# EAGLE design crz7shld (EAGLE 9.6.2)
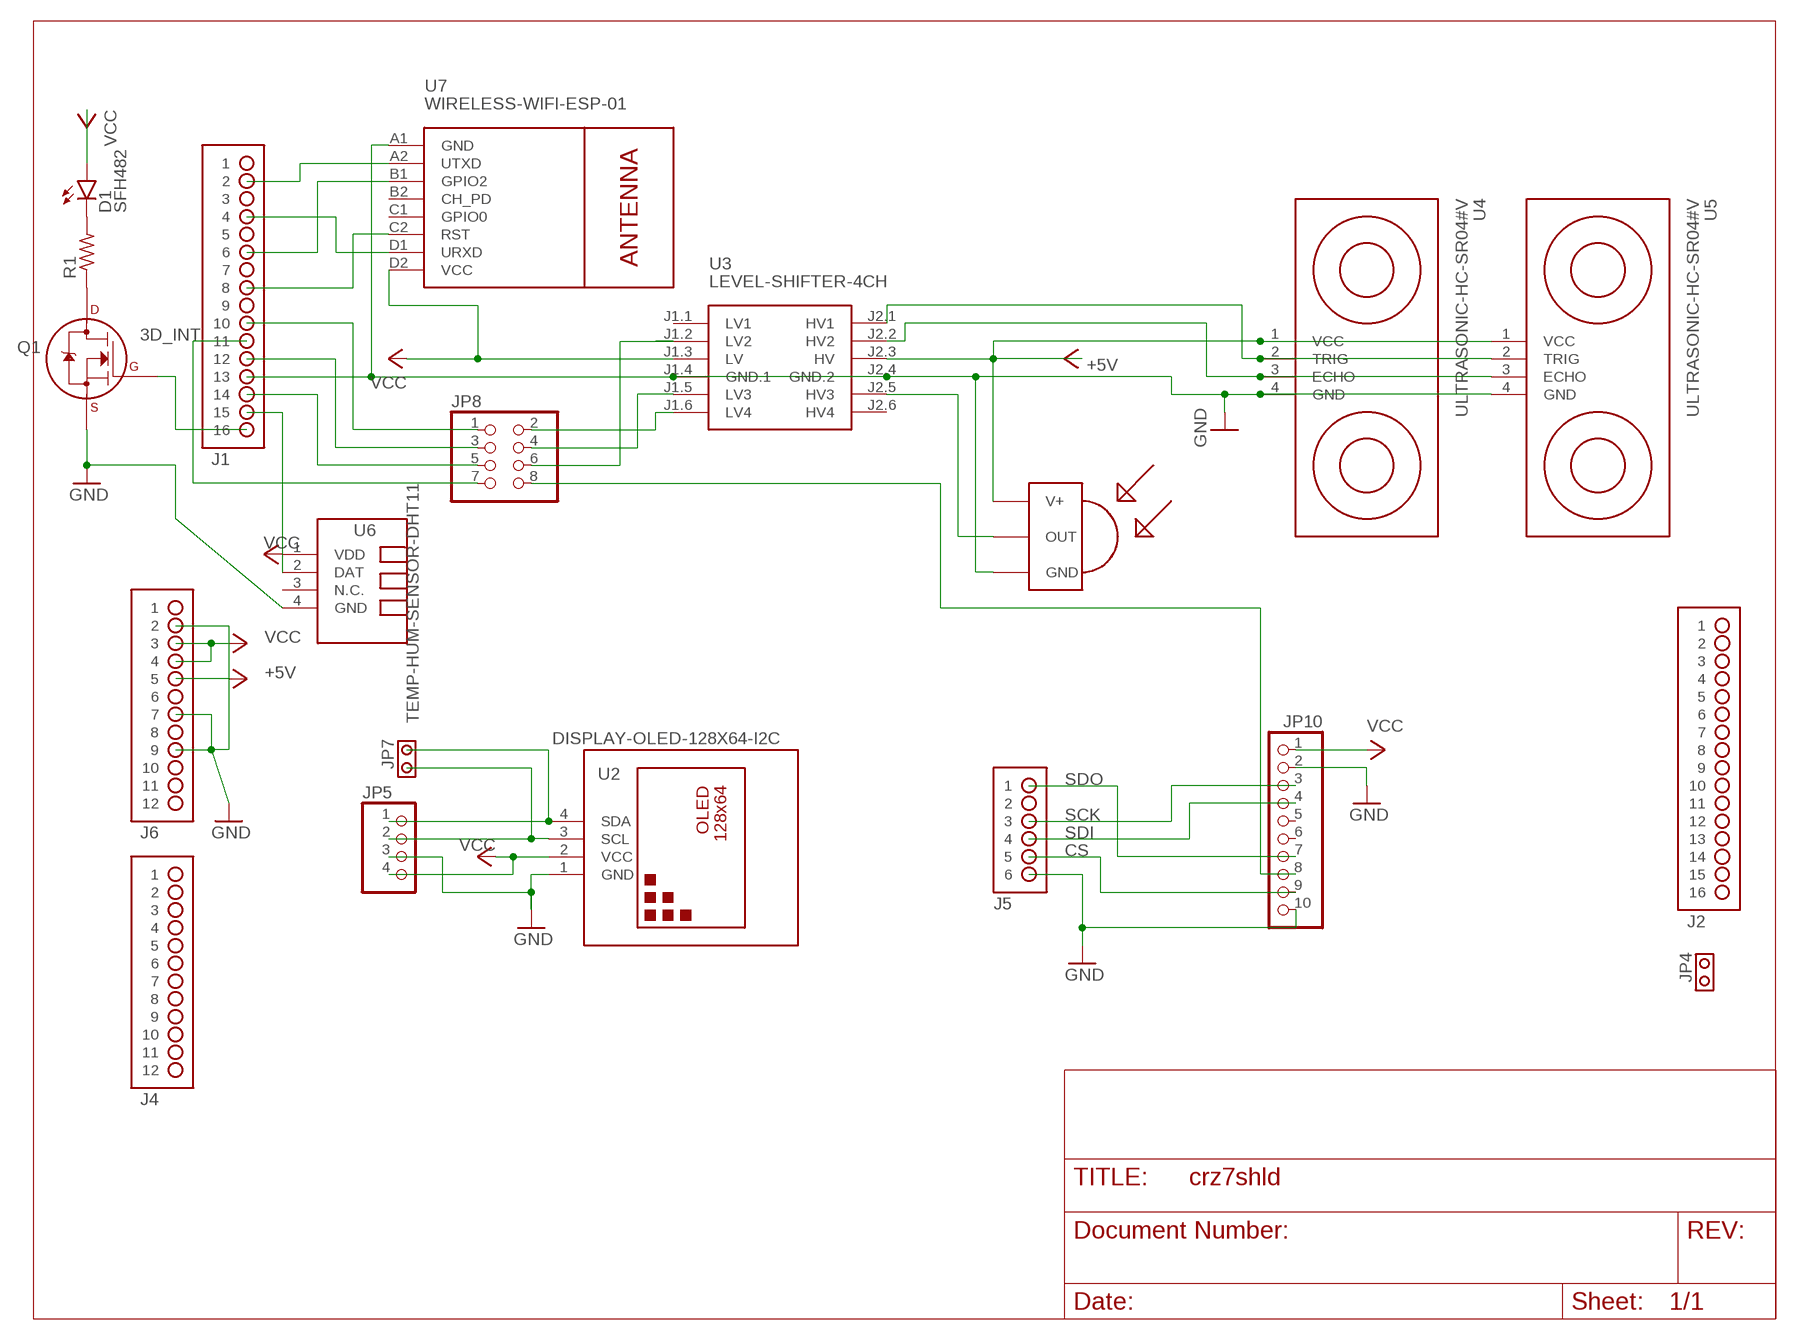
[diagram p0: schematic, sheet 1]

## Parts
D1  SFH482  [SFH482]
J1  HDR-2X8  [HDR-2X8]
J2  HDR-2X8  [HDR-2X8]
J4  HDR-2X6  [HDR-2X6]
J5  HDR-2X3  [HDR-2X3]
J6  HDR-2X6  [HDR-2X6]
JP4  JPR-1X2  [JPR-1X2]
JP5  PINHD-1X4  [1X04]
JP7  JPR-1X2  [JPR-1X2]
JP8  PINHD-2X4  [2X04]
JP10  PINHD-1X10  [1X10]
Q1  2N7000_TO92  [TO-92]
R1  R-US_0204/5  [0204/5]
U1  TSOP1833  [TSOP18XX]
U2  DISPLAY-OLED-128X64-I2C  [DISPLAY-OLED-128X64-I2C]
U3  LEVEL-SHIFTER-4CH  [LEVEL-SHIFTER-4CH]
U4  ULTRASONIC-HC-SR04#V  [ULTRASONIC-HC-SR04#V]
U5  ULTRASONIC-HC-SR04#V  [ULTRASONIC-HC-SR04#V]
U6  TEMP-HUM-SENSOR-DHT11  [TEMP-HUM-SENSOR-DHT11]
U7  WIRELESS-WIFI-ESP-01  [WIRELESS-WIFI-ESP-01]

## Nets
3D_INT: J1.11 JP8.7
+5V: J6.5 U1.VCC(V+) U3.J2.3(HV) U4.1(VCC) U5.1(VCC)
CS: J5.5 JP10.9
GND: J1.13 J5.6 J6.2 J6.7 J6.9 JP5.3 JP10.2 JP10.10 Q1.1(S) U1.GND U2.1(GND) U3.J1.4(GND.1) U3.J2.4(GND.2) U4.4(GND) U5.4(GND) U6.4(GND) U7.A1(GND)
N$1: D1.K(C) R1.2
N$2: Q1.3(D) R1.1
N$3: J1.16 Q1.2(G)
N$4: U3.J2.2(HV2) U4.3(ECHO) U5.3(ECHO)
N$5: J1.14 JP8.5
N$6: J1.12 JP8.3
N$7: U1.OUT U3.J2.5(HV3)
N$8: U3.J2.1(HV1) U4.2(TRIG) U5.2(TRIG)
N$9: J1.10 JP8.1
N$10: JP8.2 U3.J1.6(LV4)
N$11: JP8.4 U3.J1.5(LV3)
N$12: JP8.6 U3.J1.2(LV2)
N$13: J1.15 U6.2(DAT)
N$14: J1.2 U7.A2(UTXD)
N$15: J1.4 U7.D1(URXD)
N$16: J1.6 U7.B1(GPIO2)
N$17: J1.8 U7.C2(RST)
N$18: JP8.8 JP10.8
SCK: J5.3 JP10.3
SCL: JP5.2 JP7.1 U2.3(SCL)
SDA: JP5.1 JP7.2 U2.4(SDA)
SDI: J5.4 JP10.4
SDO: J5.1 JP10.7
VCC: D1.A J6.3 J6.4 JP5.4 JP10.1 U2.2(VCC) U3.J1.3(LV) U6.1(VDD) U7.D2(VCC)
Unconnected: J1.1 J1.3 J1.5 J1.7 J1.9 J2.1 J2.2 J2.3 J2.4 J2.5 J2.6 J2.7 J2.8 J2.9 J2.10 J2.11 J2.12 J2.13 J2.14 J2.15 J2.16 J4.1 J4.2 J4.3 J4.4 J4.5 J4.6 J4.7 J4.8 J4.9 J4.10 J4.11 J4.12 J5.2 J6.1 J6.6 J6.8 J6.10 J6.11 J6.12 JP4.1 JP4.2 JP10.5 JP10.6 U3.J1.1(LV1) U3.J2.6(HV4) U6.3(N.C.) U7.B2(CH_PD) U7.C1(GPIO0)

## Library data of the parts
D1 = led:SFH482: IR LED infrared emitting diode, Infineon
J1 J2 = Mechanical:HDR-2X8: 100mil 2x8 header
J4 J6 = Mechanical:HDR-2X6: 2x6 header with 42mil holes and 100mil spacing
J5 = Mechanical:HDR-2X3
JP4 JP7 = Mechanical:JPR-1X2
JP5 = pinhead:PINHD-1X4: PIN HEADER
JP8 = pinhead:PINHD-2X4: PIN HEADER
JP10 = pinhead:PINHD-1X10: PIN HEADER
Q1 = transistors:2N700*: 2N7000, 2N7002, NDS7002A N-channel enhancement mode MOSFET
R1 = rcl:R-US_: RESISTOR, American symbol; SPICEPREFIX: R
U1 = tsop:TSOP1833: IR Receiver and Demodulator
U2 = diy-modules_new:DISPLAY-OLED-128X64-I2C: 128x64 Dot Matrix OLED Module based on SSD1306 chip Variant with I2C interface More details available here: http://www.instructables.com/id/Monochrome-096-i2c-OLED-display-with-arduino-SSD13/ SSD1306 datasheet: https://cdn-shop.adafruit.com/datasheets/SSD1306.pdf Click here to find device on ebay.com <http://www.ebay.com/sch/oled+display+128x64+iic> Note: There are two variants: I2C and SPI. Search for the proper version.
U3 = diy-modules_new:LEVEL-SHIFTER-4CH: 4-Channel Bi-Directional Logic Level Converter based on BSS128 transistors Click here to find device on ebay.com <http://www.ebay.com/sch/i2c+logic+converter+module>
U4 U5 = diy-modules_new:ULTRASONIC-HC-SR04: Ultrasonic Ranging Module HC-SR04 More details available here: http://randomnerdtutorials.com/complete-guide-for-ultrasonic-sensor-hc-sr04/ Click here to find device on ebay.com <http://www.ebay.com/sch/hc+sr04+ultrasonic>
U6 = diy-modules_new:TEMP-HUM-SENSOR-DHT11: DHT11 - digital humidity & temperature sensor DHT11 datasheet available here: https://akizukidenshi.com/download/ds/aosong/DHT11.pdf Click here to find device on ebay.com <http://www.ebay.com/sch/dht11+digital+sensor>
U7 = diy-modules_new:WIRELESS-WIFI-ESP-01: Wireless Wi-Fi ESP-01 Module based on ESP8266 chip Click here to find device on ebay.com <http://www.ebay.com/sch/esp8266+esp+01+transceiver>

## Board
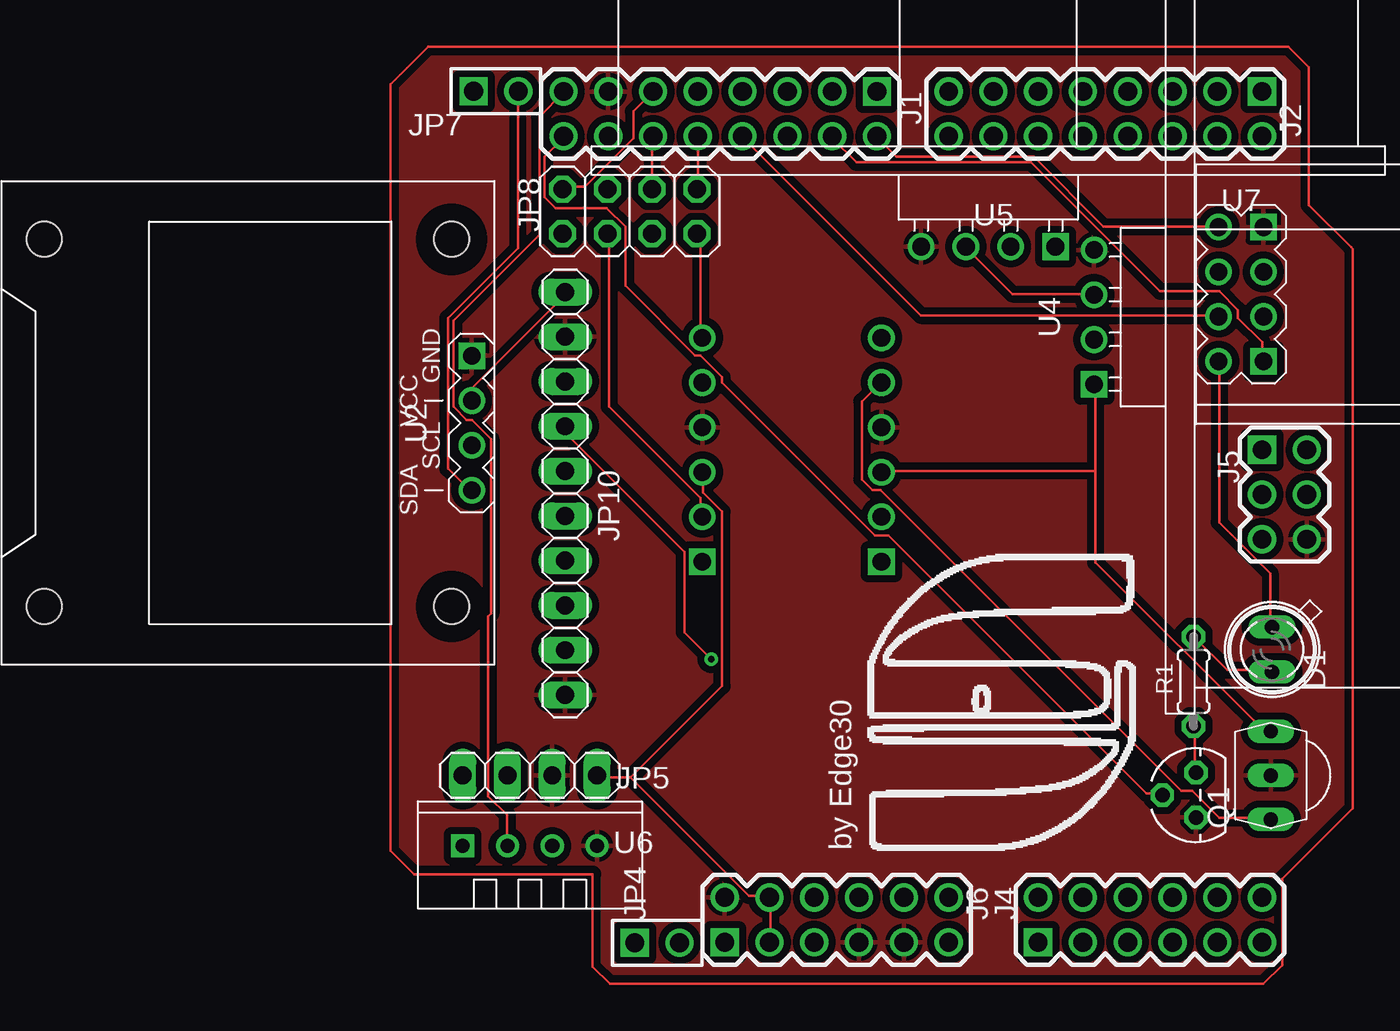
[diagram p1: board, top side]
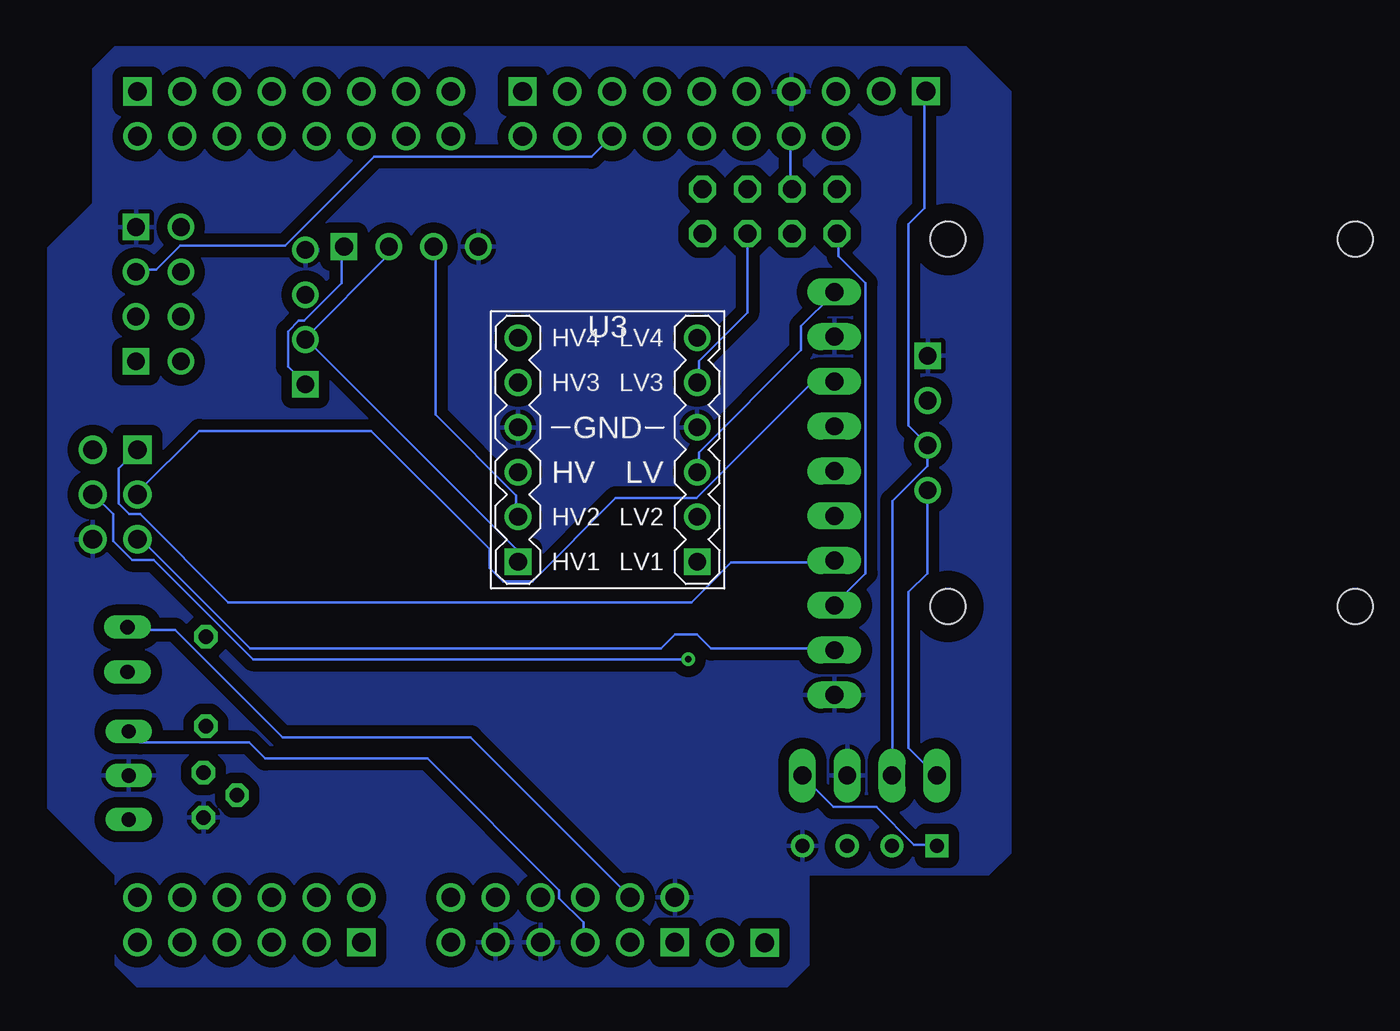
[diagram p2: board, bottom side, seen from below]

No outline drawn. Coordinates in mm, seen from the top.
Copper layers (1*16): Top 0.035mm / dielectric 0.15mm / Bottom 0.035mm
Design rules "default": minimum track width 6mil, minimum drill 0.35mm, track to track 6mil, track to pad 6mil, pad to pad 6mil, via to via 6mil, smd to smd 6mil, copper to edge 40mil, drill to drill 6mil, minimum pad ring 10mil, minimum via ring 8mil, stop-mask expansion 4mil, vias tented up to drill 0mil, thermal gap 10mil

### Footprints (pad centres in the part's own frame; a part is rotated, then mirrored left to right if it is on the bottom)
SFH482 = drill 0.813 long: A -1.27,0; K 1.27,0
HDR-2X8 = drill 1.067 square: 1 -1.27,8.89 | drill 1.067: 2 1.27,8.89; 3 -1.27,6.35; 4 1.27,6.35; 5 -1.27,3.81; 6 1.27,3.81; 7 -1.27,1.27; 8 1.27,1.27; 9 -1.27,-1.27; 10 1.27,-1.27; 11 -1.27,-3.81; 12 1.27,-3.81; 13 -1.27,-6.35; 14 1.27,-6.35; 15 -1.27,-8.89; 16 1.27,-8.89
HDR-2X6 = drill 1.067 square: 1 -1.27,6.35 | drill 1.067: 2 1.27,6.35; 3 -1.27,3.81; 4 1.27,3.81; 5 -1.27,1.27; 6 1.27,1.27; 7 -1.27,-1.27; 8 1.27,-1.27; 9 -1.27,-3.81; 10 1.27,-3.81; 11 -1.27,-6.35; 12 1.27,-6.35
HDR-2X3 = drill 1.067 square: 1 -1.27,2.54 | drill 1.067: 2 1.27,2.54; 3 -1.27,0; 4 1.27,0; 5 -1.27,-2.54; 6 1.27,-2.54
JPR-1X2 = drill 1.067 square: 1 0,1.27 | drill 1.067: 2 0,-1.27
1X04 = drill 1.016 long: 1 -3.81,0; 2 -1.27,0; 3 1.27,0; 4 3.81,0
2X04 = drill 1.016 octagon: 1 -3.81,-1.27; 2 -3.81,1.27; 3 -1.27,-1.27; 4 -1.27,1.27; 5 1.27,-1.27; 6 1.27,1.27; 7 3.81,-1.27; 8 3.81,1.27
1X10 = drill 1.016 long: 1 -11.43,0; 2 -8.89,0; 3 -6.35,0; 4 -3.81,0; 5 -1.27,0; 6 1.27,0; 7 3.81,0; 8 6.35,0; 9 8.89,0; 10 11.43,0
TO-92 = drill 0.813 octagon: 1 -1.27,0; 2 0,1.905; 3 1.27,0
0204/5 = drill 0.813 octagon: 1 -2.54,0; 2 2.54,0
TSOP18XX = drill 0.813 long: GND -0.001,-0.027; OUT -2.501,-0.027; VCC 2.499,-0.027
DISPLAY-OLED-128X64-I2C = drill 1 square: 1 -3.81,12.7 | drill 1: 2 -1.27,12.7; 3 1.27,12.7; 4 3.81,12.7 | hole 2: -10.414,11.557; 10.414,11.557; 10.414,-11.557; -10.414,-11.557
LEVEL-SHIFTER-4CH = drill 1 square: J1.1 -5.08,6.35; J2.1 5.08,6.35 | drill 1: J1.2 -5.08,3.81; J1.3 -5.08,1.27; J1.4 -5.08,-1.27; J1.5 -5.08,-3.81; J1.6 -5.08,-6.35; J2.2 5.08,3.81; J2.3 5.08,1.27; J2.4 5.08,-1.27; J2.5 5.08,-3.81; J2.6 5.08,-6.35
ULTRASONIC-HC-SR04#V = drill 1 square: 1 -3.81,0 | drill 1: 2 -1.27,0; 3 1.27,0; 4 3.81,0
TEMP-HUM-SENSOR-DHT11 = drill 0.8 square: 1 -3.81,0 | drill 0.8: 2 -1.27,0; 3 1.27,0; 4 3.81,0
WIRELESS-WIFI-ESP-01 = drill 1 square: A1 -8.89,3.81; D1 -8.89,-3.81 | drill 1: A2 -11.43,3.81; B1 -8.89,1.27; B2 -11.43,1.27; C1 -8.89,-1.27; C2 -11.43,-1.27; D2 -11.43,-3.81

### Placement (x,y rotation side)
D1  50.09,19.14 270 top
J1  18.8,49.53 270 top
J2  40.64,49.53 270 top
J4  43.18,3.81 90 top
J5  50.8,27.94 0 top
J6  25.4,3.81 90 top
JP4  15.22,2.51 90 top
JP5  8,12 0 top
JP7  6.07,50.83 90 top
JP8  13.67,44 180 top
JP10  10,28 270 top
Q1  45.78,10.89 90 top
R1  45.64,17.34 90 top
U1  50,12 90 top
U2  -8,32 270 top
U3  22.86,30.48 180 bottom
U4  40,38 90 top
U5  34,42 180 top
U6  8,8 0 top
U7  58.5,39.3 0 top

### Tracks (layer width: path | path; a pad name or v marks a point on that pad's centre or on a via)
3D_INT
  Top 0.152: J1.11 13.87,49.68 13.87,48.16 11.12,45.41 9.91,45.41 JP8.7
+5V
  Top 0.152: 40.08,29.26 40.08,34.14 U4.1 | 40.08,29.26 40.08,24.08 49.53,14.63 49.99,14.63 U1.VCC | 40.08,29.26 28.04,29.26 U3.J2.3
  Bottom 0.152: U5.1 37.95,41.91 37.95,39.93 40.08,37.8 40.39,37.8 41,37.19 41,35.2 40.08,34.29 U4.1 | J6.5 24.23,2.59 24.23,3.66 25.6,5.03 25.6,5.49 33.08,12.97 42.28,12.97 43.18,13.87 49.38,13.87 49.99,14.48 U1.VCC
CS
  Bottom 0.152: JP10.9 10.06,19.2 16.99,19.2 17.78,19.99 19.05,19.99 19.84,19.2 43.13,19.2 49.23,25.3 49.53,25.3 J5.5
GND
  Top 0.152: 29.11,2.59 J6.9
  pour Bottom (isolate 0.61): 3.81,53.34 50.8,53.34 52.07,52.07 52.07,44.45 54.61,41.91 54.61,10.16 52.07,7.62 50.8,6.35 50.8,1.27 49.53,0 12.7,0 11.43,1.27 11.43,6.35 1.27,6.35 0,7.62 0,50.8 2.54,53.34
  pour Top (isolate 0.406): 0,50.8 2.54,53.34 50.8,53.34 52.07,52.07 52.07,44.45 54.61,41.91 54.61,10.16 50.8,6.35 50.8,1.27 49.53,0 12.7,0 11.43,1.27 11.43,6.35 1.27,6.35 0,7.62
N$1
  Top 0.152: D1.K 49.99,17.98 47.55,17.98 45.72,19.81 R1.2
N$2
  Top 0.152: R1.1 45.72,14.78 45.72,12.19 Q1.3
N$3
  Top 0.152: Q1.2 43.74,10.97 42.98,10.97 28.35,25.6 27.58,25.6 18.9,34.29 18.9,34.59 17.68,35.81 17.37,35.81 13.41,39.78 13.41,43.13 12.34,44.2 9.45,44.2 8.84,44.81 8.84,47.09 9.91,48.16 J1.16
N$4
  Top 0.152: U4.3 39.93,39.32 35.36,39.32 32.77,41.91 U5.3
  Bottom 0.152: U3.J2.2 28.04,26.67 28.04,27.89 32.61,32.46 32.61,41.91 U5.3
N$5
  Bottom 0.152: JP8.5 12.5,45.41 12.5,48.16 J1.14
N$6
  Top 0.152: JP8.3 14.94,48.16 J1.12
N$7
  Top 0.152: U1.OUT 49.99,9.6 47.09,9.6 45.57,11.12 44.96,11.12 27.89,28.19 27.43,28.19 26.82,28.8 26.82,33.22 27.89,34.29 U3.J2.5
N$8
  Bottom 0.152: U3.J2.1 28.04,24.23 28.04,24.84 39.93,36.73 U4.2 39.93,36.88 35.36,41.45 35.36,41.91 U5.2
N$9
  Top 0.152: J1.10 17.53,45.41 JP8.1
N$10
  Top 0.152: U3.J1.6 17.68,36.88 17.68,42.52 17.53,42.67 JP8.2
N$11
  Bottom 0.152: JP8.4 14.94,38.25 17.68,35.51 17.68,34.29 U3.J1.5
N$12
  Top 0.152: U3.J1.2 17.68,26.67 17.68,27.74 12.5,32.92 12.5,42.67 JP8.6
N$13
  Top 0.152: U6.2 6.71,8.08 6.71,9.75 5.64,10.82 5.64,21.03 5.79,21.18 5.79,31.09 4.72,32.16 4.42,32.16 3.66,32.92 3.66,37.8 8.53,42.67 8.53,49.38 9.91,50.75 J1.15
N$14
  Top 0.152: U7.A2 46.94,43.13 40.54,43.13 36.58,47.09 28.8,47.09 27.74,48.16 J1.2
N$15
  Top 0.152: U7.D1 49.53,35.51 49.53,36.58 48.16,37.95 48.16,38.41 47.09,39.47 43.74,39.47 36.42,46.79 26.52,46.79 25.15,48.16 J1.4
N$16
  Bottom 0.152: J1.6 23.77,47.09 36.12,47.09 41.15,42.06 47.09,42.06 48.46,40.69 49.53,40.69 U7.B1
N$17
  Top 0.152: U7.C2 46.94,38.1 30.18,38.1 20.12,48.16 J1.8
N$18
  Bottom 0.152: JP8.8 9.75,42.67 9.75,41.45 8.23,39.93 8.23,23.47 9.91,21.79 JP10.8
N$20
  Top 0.152: 54.67,41.87 54.67,10.13 50.67,6.13 50.67,1.25 49.61,0.18 12.54,0.18 11.56,1.16 11.56,6.4 1.42,6.4 0.09,7.73 0.09,51.21 2.22,53.34 2.49,53.34 4.09,53.34 51.03,53.34 52.18,52.18 52.18,44.36 54.59,41.96
SCK
  Bottom 0.152: JP10.3 10.06,34.29 11.28,34.29 17.83,27.74 22.4,27.74 27.13,23.01 28.8,23.01 29.57,23.77 29.57,24.84 36.27,31.55 46.02,31.55 49.53,28.04 J5.3
SCL
  Bottom 0.152: JP5.2 6.71,12.04 6.71,27.58 4.72,29.57 4.72,30.63 U2.3 4.72,30.79 5.79,31.85 5.79,43.28 4.88,44.2 4.88,50.75 JP7.1
SDA
  Top 0.152: JP7.2 7.32,50.75 7.32,41.91 3.35,37.95 3.35,29.41 4.57,28.19 U2.4
  Bottom 0.152: U2.4 4.72,28.04 4.72,23.47 5.79,22.4 5.79,13.56 4.27,12.04 JP5.1
SDI  (via drill 0.35)
  Top 0.152: v18.29,18.59 16.76,20.12 16.76,24.69 10.06,31.39 10.06,31.7 JP10.4
  Bottom 0.152: v18.29,18.59 42.98,18.59 48.62,24.23 49.84,24.23 50.9,25.3 50.9,26.82 51.97,27.89 J5.4
SDO
  Bottom 0.152: J5.1 50.6,29.41 50.6,27.43 49.99,26.82 49.38,26.82 44.37,21.82 20.42,21.82 18.9,21.82 18.11,21.82 17.22,22.71 17.12,22.81 15.85,24.08 10.06,24.08 JP10.7
VCC
  Top 0.152: U2.2 4.72,33.38 4.72,33.98 10.06,39.32 JP10.1 | D1.A 49.99,20.42 49.99,23.47 47.09,26.36 47.09,35.36 U7.D2 | J6.3 21.64,2.59 21.64,5.03 J6.4 21.49,5.18 20.42,5.18 13.72,11.89 | 13.72,11.89 11.89,11.89 JP5.4 | 13.72,11.89 18.9,17.07 18.9,26.98 17.83,28.04 17.83,29.11 U3.J1.3
  Bottom 0.152: U3.J1.3 17.68,29.26 17.68,30.33 11.89,36.12 11.89,37.49 10.06,39.32 JP10.1 | U6.1 4.27,8.08 5.49,8.08 7.62,10.21 10.06,10.21 11.73,11.89 JP5.4 | D1.A 49.99,20.27 47.4,20.27 41.3,14.17 30.63,14.17 21.64,5.18 J6.4

### Text on the board
tNames: by Edge30